# EAGLE design radiationsensor_r0 (EAGLE 6.5.0)
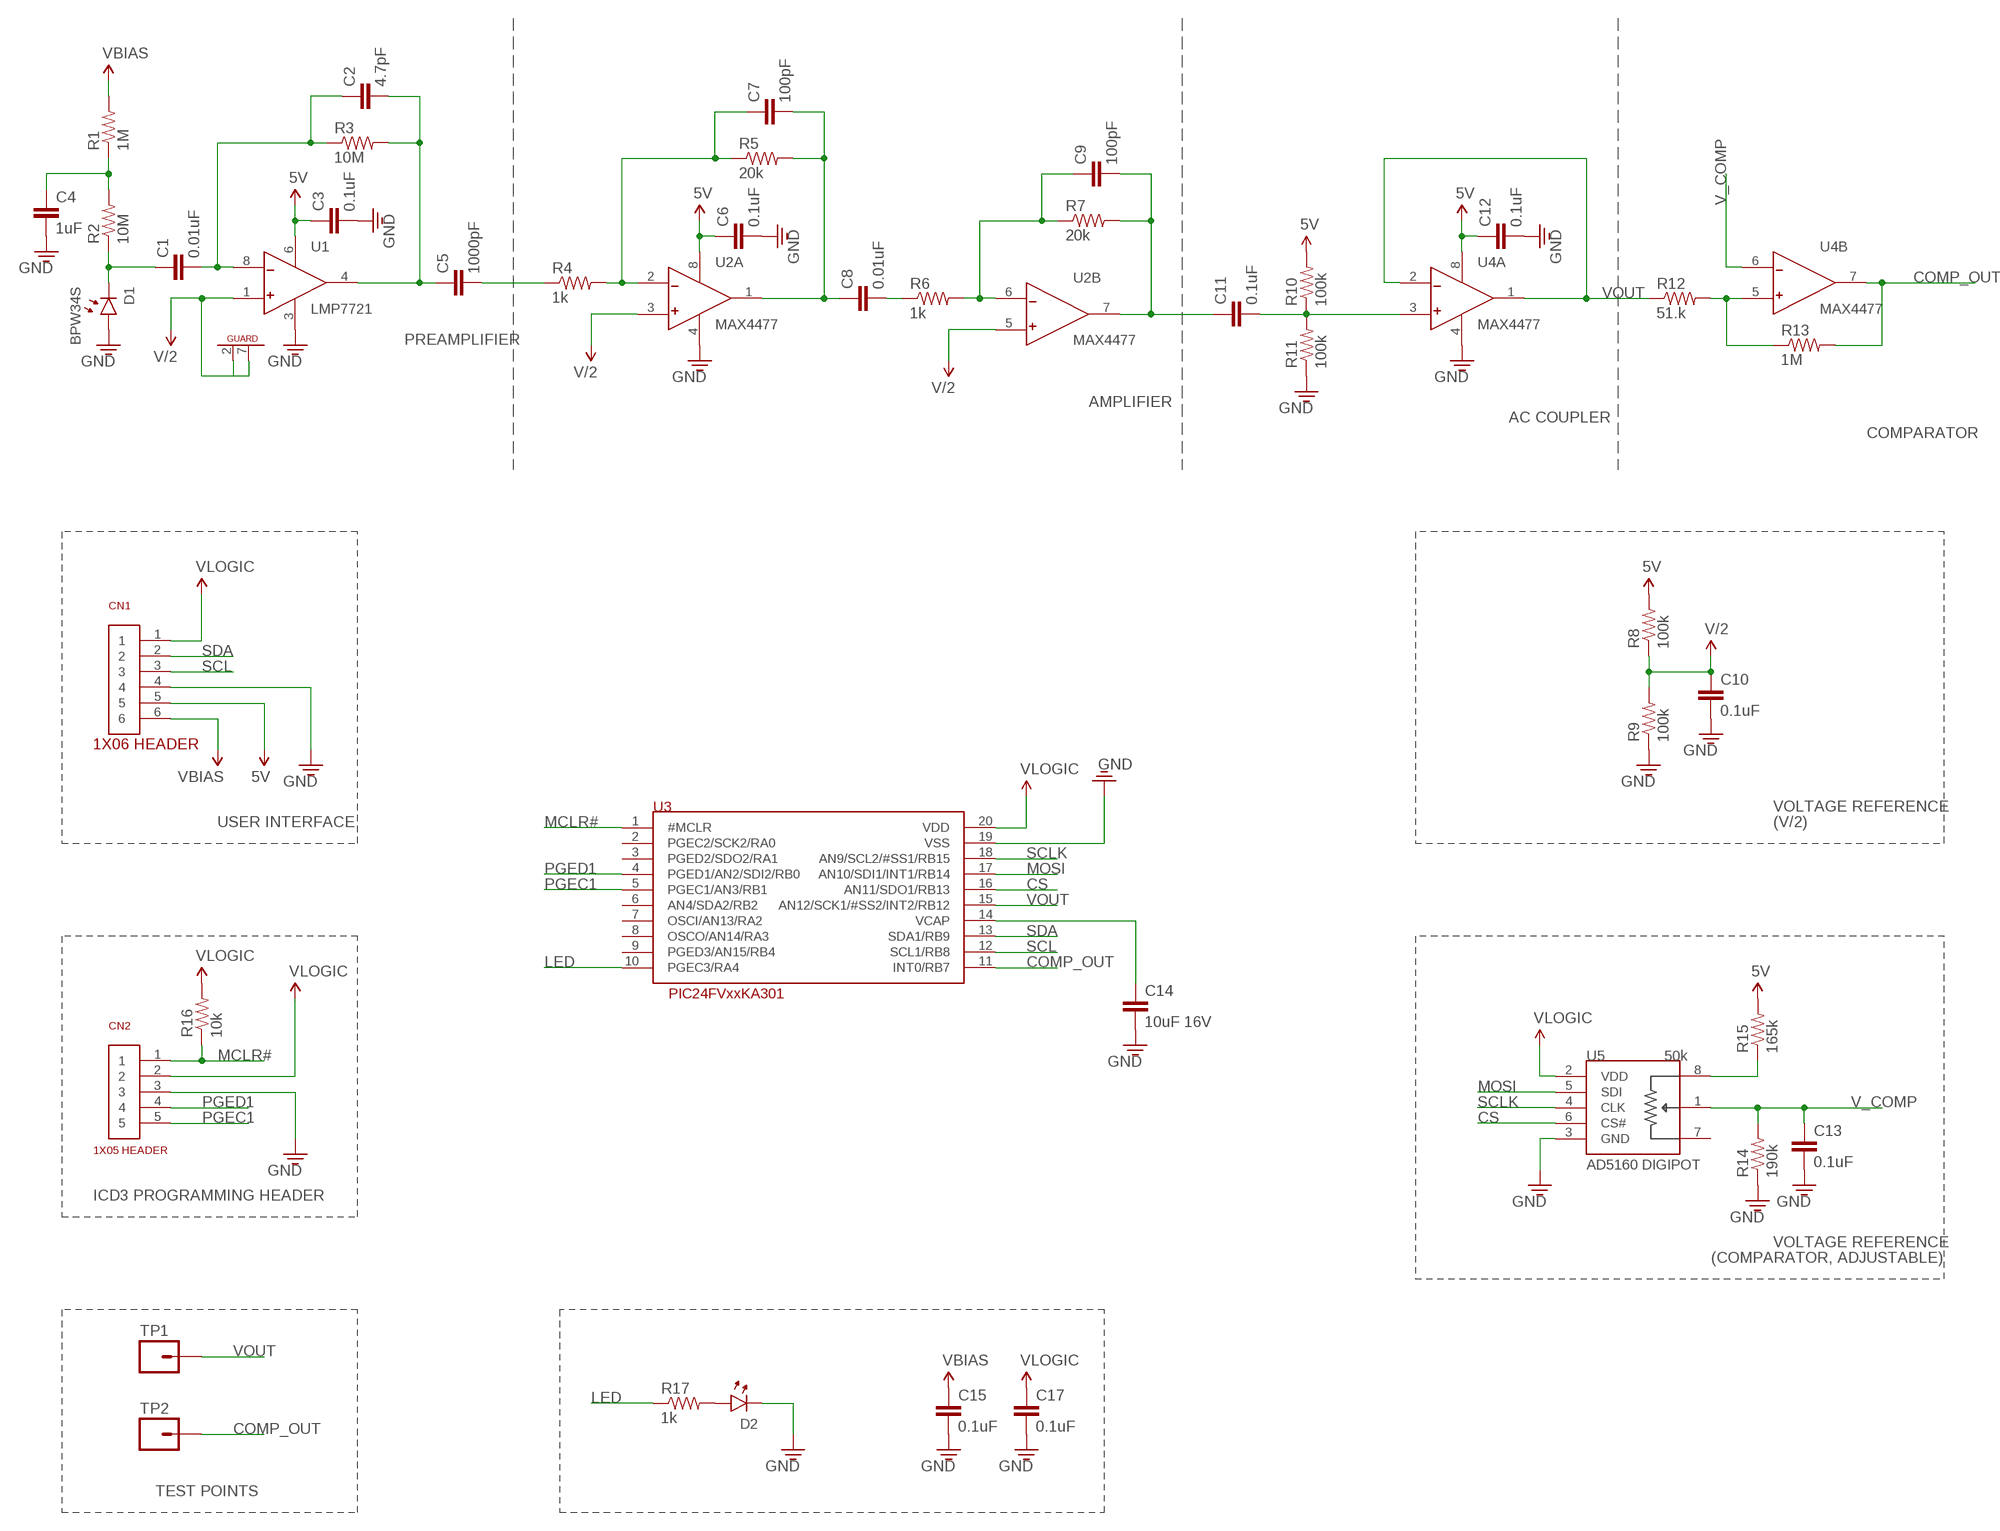
[diagram p0: schematic, sheet 1]

## Parts
C1  0.01uF  CAP0603  [0603]
C2  4.7pF  CAP0603  [0603]
C3  0.1uF  CAP0603  [0603]
C4  1uF  CAP0603  [0603]
C5  1000pF  CAP0603  [0603]
C6  0.1uF  CAP0603  [0603]
C7  100pF  CAP0603  [0603]
C8  0.01uF  CAP0603  [0603]
C9  100pF  CAP0603  [0603]
C10  0.1uF  CAP0603  [0603]
C11  0.1uF  CAP0603  [0603]
C12  0.1uF  CAP0603  [0603]
C13  0.1uF  CAP0603  [0603]
C14  10uF 16V  CAP0805  [0805]
C15  0.1uF  CAP0603  [0603]
C17  0.1uF  CAP0603  [0603]
CN1  1X06  [1X06]
CN2  1X05  [1X05]
D1  BPW34S  PHOTODIODE  [BPW34S-SIDEMOUNT]
D2  0605-LED  [0603-LED]
R1  1M  RESISTOR0603  [0603]
R2  10M  RESISTOR0603  [0603]
R3  10M  RESISTOR0603  [0603]
R4  1k  RESISTOR0603  [0603]
R5  20k  RESISTOR0603  [0603]
R6  1k  RESISTOR0603  [0603]
R7  20k  RESISTOR0603  [0603]
R8  100k  RESISTOR0603  [0603]
R9  100k  RESISTOR0603  [0603]
R10  100k  RESISTOR0603  [0603]
R11  100k  RESISTOR0603  [0603]
R12  51.k  RESISTOR0603  [0603]
R13  1M  RESISTOR0603  [0603]
R14  190k  RESISTOR0603  [0603]
R15  165k  RESISTOR0603  [0603]
R16  10k  RESISTOR0603  [0603]
R17  1k  RESISTOR0603  [0603]
TP1  M01PTH  [1X01]
TP2  M01PTH  [1X01]
U1  LMP7721  OPAMP-LMP7721  [SOIC-8]
U2  MAX4477  OPAMP-MAX4477  [SOIC-8]
U3  PIC24FVXXKA301  [SOIC-20]
U4  MAX4477  OPAMP-MAX4477  [SOIC-8]
U5  50k  AD5160  [SOT-23-8]

## Nets
5V: C3.1 C6.1 C12.1 CN1.5 R8.2 R10.2 R15.2 U1.6(VCC) U2.8(A:V+) U4.8(A:V+)
COMP_OUT: R13.2 TP2.1 U3.11(INT0/RB7) U4.7(B:OUT)
CS: U3.16(AN11/SDO1/RB13) U5.6(CS#)
GND: C3.2 C4.2 C6.2 C10.2 C12.2 C13.2 C14.2 C15.2 C17.2 CN1.4 CN2.3 D1.A(ANODE) D2.CATHODE R9.1 R11.1 R14.1 U1.3(GND) U2.4(A:V-) U3.19(VSS) U4.4(A:V-) U5.3(GND)
LED: R17.1 U3.10(PGEC3/RA4)
MCLR#: CN2.1 R16.1 U3.1(#MCLR)
MOSI: U3.17(AN10/SDI1/INT1/RB14) U5.5(SDI)
N$1: C1.2 C2.1 R3.1 U1.8(-)
N$2: C1.1 D1.C(CATHODE) R2.1
N$3: C7.2 C8.1 R5.2 U2.1(A:OUT)
N$4: C4.1 R1.1 R2.2
N$5: C7.1 R4.2 R5.1 U2.2(A:-)
N$6: C5.2 R4.1
N$7: C2.2 C5.1 R3.2 U1.4(OUT)
N$8: C9.1 R6.2 R7.1 U2.6(B:-)
N$9: C8.2 R6.1
N$10: C11.2 R10.1 R11.2 U4.3(A:+)
N$11: C9.2 C11.1 R7.2 U2.7(B:OUT)
N$12: D2.ANODE R17.2
N$14: R12.2 R13.1 U4.5(B:+)
N$15: C14.1 U3.14(VCAP)
N$17: R15.1 U5.8(A)
PGEC1: CN2.5 U3.5(PGEC1/AN3/RB1)
PGED1: CN2.4 U3.4(PGED1/AN2/SDI2/RB0)
SCL: CN1.3 U3.12(SCL1/RB8)
SCLK: U3.18(AN9/SCL2/#SS1/RB15) U5.4(CLK)
SDA: CN1.2 U3.13(SDA1/RB9)
V/2: C10.1 R8.1 R9.2 U1.1(+) U1.2(G1) U1.7(G2) U2.3(A:+) U2.5(B:+)
V_COMP: C13.1 R14.2 U4.6(B:-) U5.1(W)
VBIAS: C15.1 CN1.6 R1.2
VLOGIC: C17.1 CN1.1 CN2.2 R16.2 U3.20(VDD) U5.2(VDD)
VOUT: R12.1 TP1.1 U3.15(AN12/SCK1/#SS2/INT2/RB12) U4.1(A:OUT) U4.2(A:-)
Unconnected: U3.2(PGEC2/SCK2/RA0) U3.3(PGED2/SDO2/RA1) U3.6(AN4/SDA2/RB2) U3.7(OSCI/AN13/RA2) U3.8(OSCO/AN14/RA3) U3.9(PGED3/AN15/RB4) U5.7(B)

## Notes on the sheet
- PREAMPLIFIER
- AMPLIFIER
- AC COUPLER
- COMPARATOR
- VOLTAGE REFERENCE
- USER INTERFACE | (V/2)
- ICD3 PROGRAMMING HEADER
- VOLTAGE REFERENCE
- (COMPARATOR, ADJUSTABLE)
- TEST POINTS

## Library data of the parts
C1-C15 C17 = openct:CAP: Capacitor Standard 0603 ceramic capacitor, and 0.1" leaded capacitor.
CN1 = openct:1X06
CN2 = openct:1X05
D1 = openct:PHOTODIODE: Photodiodes sensitive to high-energy particles
D2 = openct:0605-LED
R1-R17 = openct:RESISTOR: Resistor Basic schematic elements and footprints for 0603, 1206, and PTH 1/10th watt (small) resistors.
TP1 TP2 = SparkFun-Connectors:M01: Header 1 Standard 1-pin 0.1" header. Use with straight break away headers (SKU : PRT-00116), right angle break away headers (PRT-00553), swiss pins (PRT-00743), machine pins (PRT-00117), and female headers (PRT-00115).
U1 = openct:OPAMP-LMP7721: TI LMP7721 Precision Amplifier (3-Femtoamp Input Bias)
U2 U4 = openct:OPAMP-MAX4477: Maxim MAX4477 Low-noise, low-distortion dual op amp
U3 = openct:PIC24FVXXKA301: Microchip PIC24FVxxKA301 microcontroller (2k ram, 12-bit adc, 2-5.5V operating voltage)
U5 = openct:AD5160: AD5160 Digipot (256-Position, SPI-Compatible)

## Board
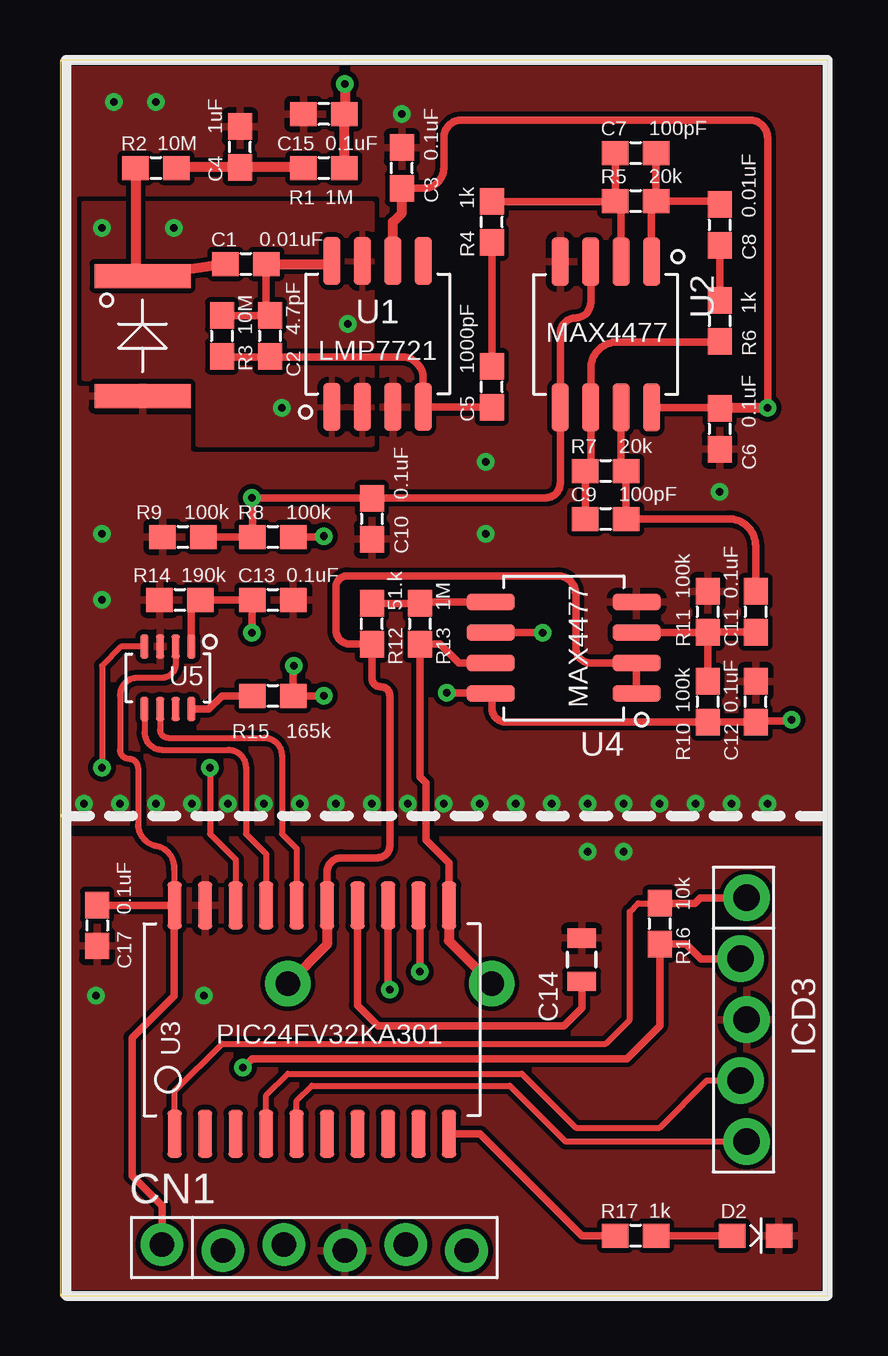
[diagram p1: board, top side]
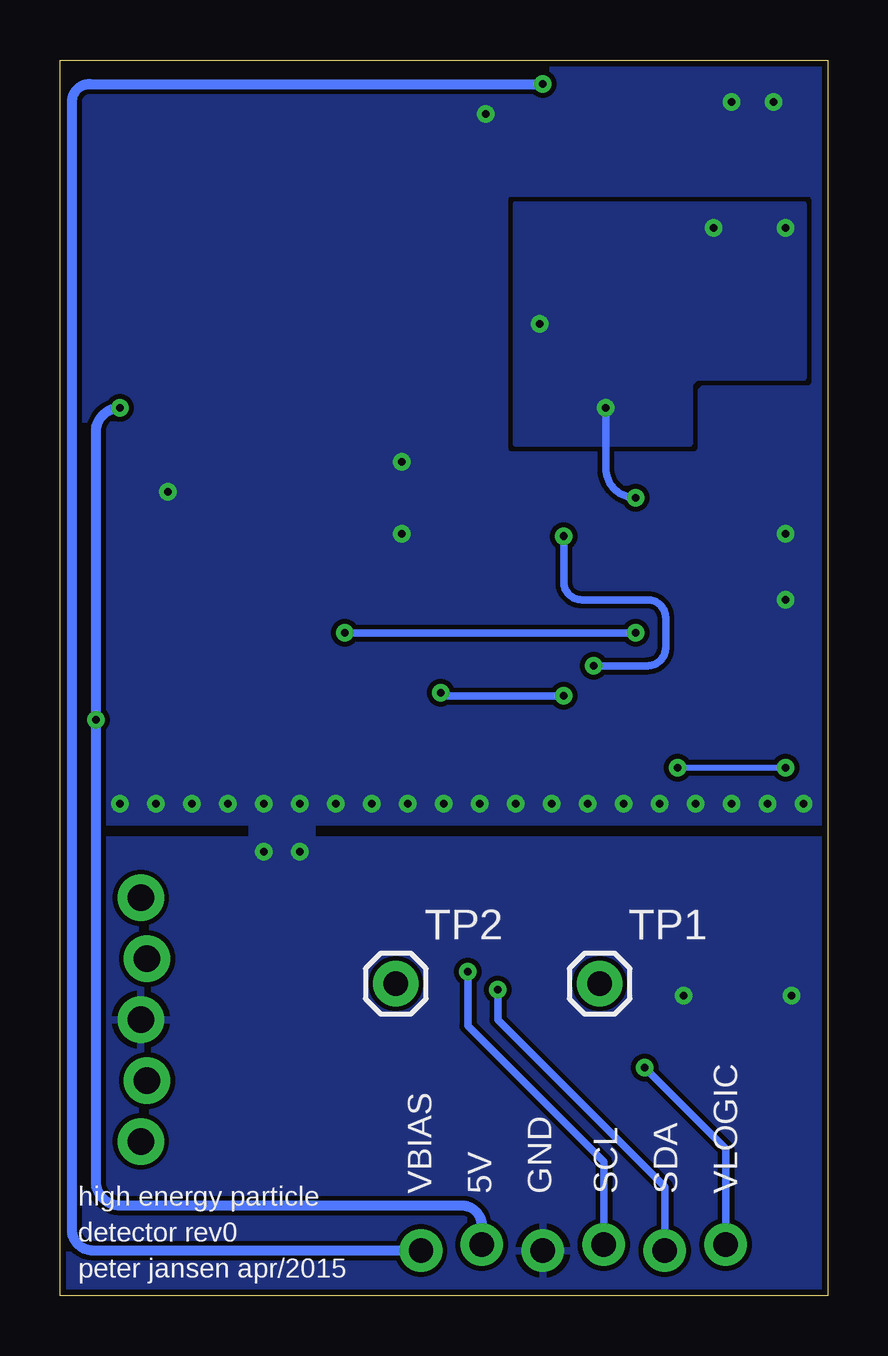
[diagram p2: board, bottom side, seen from below]

Size 32 x 51.5 mm. Coordinates in mm from the lower left corner, seen from the top.
Outline: 0,0 32,0 32,51.5 0,51.5 0,0
Copper layers (1*16): Top 0.035mm / dielectric 1.5mm / Bottom 0.035mm
Design rules "default *": minimum track width 10mil, minimum drill 13mil, track to track 8mil, track to pad 8mil, pad to pad 8mil, via to via 8mil, smd to smd 8mil, copper to edge 10mil, drill to drill 8mil, minimum pad ring 10mil, minimum via ring 8mil, stop-mask expansion 4mil, vias tented up to drill 0mil, thermal gap 10mil

### Footprints (pad centres in the part's own frame; a part is rotated, then mirrored left to right if it is on the bottom)
0603 = smd 1.1 x 1: 1 -0.85,0; 2 0.85,0
0805 = smd 0.8 x 1.2: 1 -0.9,0; 2 0.9,0
1X06 = drill 1.016 pad 1.778: 1 0,0.127; 2 2.54,-0.127; 3 5.08,0.127; 4 7.62,-0.127; 5 10.16,0.127; 6 12.7,-0.127
1X05 = drill 1.1 pad 1.93: 1 -5.08,0.127; 2 -2.54,-0.127; 3 0,0.127; 4 2.54,-0.127; 5 5.08,0.127
BPW34S-SIDEMOUNT = smd 1 x 4: A -2.5,-0.5; C 2.5,-0.5
0603-LED = smd 1.1 x 1: ANODE -0.975,0; CATHODE 0.975,0
1X01 = drill 1.016 pad 1.88: 1 0,0
SOIC-8 = smd 0.7 x 2: 1 -1.905,-3.04; 2 -0.635,-3.04; 3 0.635,-3.04; 4 1.905,-3.04; 5 1.905,3.04; 6 0.635,3.04; 7 -0.635,3.04; 8 -1.905,3.04
SOIC-20 = smd 0.6 x 2: 1 -5.715,-4.762; 2 -4.445,-4.762; 3 -3.175,-4.762; 4 -1.905,-4.762; 5 -0.635,-4.762; 6 0.635,-4.762; 7 1.905,-4.762; 8 3.175,-4.762; 9 4.445,-4.762; 10 5.715,-4.762; 11 5.715,4.763; 12 4.445,4.763; 13 3.175,4.763; 14 1.905,4.763; 15 0.635,4.763; 16 -0.635,4.763; 17 -1.905,4.763; 18 -3.175,4.763; 19 -4.445,4.763; 20 -5.715,4.763
SOT-23-8 = smd 0.35 x 1: 1 -0.975,-1.3; 2 -0.325,-1.3; 3 0.325,-1.3; 4 0.975,-1.3; 5 0.975,1.3; 6 0.325,1.3; 7 -0.325,1.3; 8 -0.975,1.3

### Placement (x,y rotation side)
C1  7.75,43 0 top
C2  8.75,40 270 top
C3  14.25,47 90 top
C4  7.5,47.88 90 top
C5  18,37.88 90 top
C6  27.5,36.12 270 top
C7  24,47.62 0 top
C8  27.5,44.62 270 top
C9  22.75,32.38 0 top
C10  13,32.38 270 top
C11  29,28.5 270 top
C12  29,24.75 90 top
C13  8.88,29 0 top
C14  21.75,14 90 top
C15  11,49.25 180 top
C17  1.55,15.42 270 top
CN1  4.25,2 0 top
CN2  28.5,11.5 270 top
D1  2.94,39.99 90 top
D2  29,2.5 0 top
R1  11,47 0 top
R2  4,47 0 top
R3  6.75,40 270 top
R4  18,44.75 90 top
R5  24,45.62 0 top
R6  27.5,40.62 270 top
R7  22.75,34.38 0 top
R8  8.88,31.62 0 top
R9  5.12,31.62 0 top
R10  27,24.75 270 top
R11  27,28.5 270 top
R12  13,28 90 top
R13  15,28 270 top
R14  5,29 0 top
R15  8.88,25 0 top
R16  25,15.5 270 top
R17  24,2.5 0 top
TP1  9.5,13 0 bottom
TP2  18,13 0 bottom
U1  13.24,40.08 0 top
U2  22.76,40.05 180 top
U3  10.5,11.5 0 top
U4  21,27 90 top
U5  4.5,25.75 180 top

### Tracks (layer width: path | path; a pad name or v marks a point on that pad's centre or on a via)
5V  (via drill 0.33)
  Top 0.305: U2.8 27.46,37.02 arc90 C6.1 | v29.5,37 29.5,48.25 arc90 28.75,49 16.75,49 arc90 16,48.25 16,47 arc-90 15.15,46.15 C3.1 | R10.2 18.6,23.9 arc-90 18,24.5 18,25.05 U4.8 17.91,25.05 arc-90 17.86,25.12 v16.12,25.12 | v9.75,26.25 9.73,26.23 R15.2 v11,25 | R8.2 10.98,31.62 v11,31.65 | v30.5,24 30.45,23.95 29.12,23.95 C12.1 R10.2 | R10.2 27.08,23.83
  Top 0.406: U1.6 13.88,44.75 14.25,45.12 C3.1 | v29.5,37 27.52,37 arc90 C6.1
  Bottom 0.305: v9.75,26.25 7.5,26.25 arc-90 6.75,27 6.75,28.25 arc-90 7.5,29 10.25,29 arc90 11,29.75 v11,31.65 | v16.12,25.12 16,25 v11,25
  Bottom 0.406: CN1.5 14.41,2.91 arc-90 15.25,3.75 29.5,3.75 arc90 30.5,4.75 v30.5,24 30.5,36 arc90 v29.5,37
COMP_OUT
  Top 0.305: U4.7 16.64,26.37 15.85,27.15 R13.2 15,21.62 15.25,21.38 15.25,19 16.21,18.04 U3.11
  Top 0.406: U3.11 16.21,14.79 TP2.1
CS
  Top 0.254: U5.6 4.18,23.58 arc90 4.5,23.25 8.5,23.25 arc-90 9.25,22.5 9.25,19.25 9.86,18.64 U3.16
GND  (via drill 0.33)
  other vias: 1,20.5 2.5,20.5 4,20.5 5.5,20.5 7,20.5 8.5,20.5 10,20.5 11.5,20.5 13,20.5 14.5,20.5 16,20.5 17.5,20.5 19,20.5 20.5,20.5 22,20.5 23.5,20.5 25,20.5 26.5,20.5 28,20.5 29.5,20.5 22,18.5 23.5,18.5 6,12.5 1.5,12.5 17.75,31.75 1.75,31.75 1.75,29 17.75,34.75 2.25,49.75 4,49.75 14.25,49.25 27.5,33.5
  pour Top (rank 3): 0.25,19.75 0.25,51.5 32,51.5 32,19.75
  pour Bottom (rank 3): 0.25,19.75 0.25,51.5 32,51.5 32,19.75
  pour Bottom (rank 3): 0.25,0 0.25,19 32,19 32,0
  pour Top (rank 3): 0.25,19 32,19 32,0 0.25,0
  pour Bottom (rank 3): 21.5,21 21.5,18 24,18 24,21
LED
  Top 0.305: U3.10 17.51,6.74 21.75,2.5 R17.1
MCLR#
  Top 0.254: U3.1 4.79,8.54 6.75,10.5 22.75,10.5 23.75,11.5 23.75,16 24.1,16.35 R16.1
  Top 0.305: CN2.1 26.7,16.58 26.48,16.35 R16.1
MOSI
  Top 0.254: U5.5 3.53,23.48 arc90 4.25,22.75 7,22.75 arc-90 7.75,22 7.75,19.25 8.59,18.41 U3.17
N$1
  Top 0.305: R3.1 C2.1 arc-90 8.6,41 C1.2
  Top 0.406: C1.2 11.21,43 arc90 U1.8
N$2
  Top 0.406: C1.1 D1.C 3.15,42.49 R2.1
N$3
  Top 0.305: C7.2 R5.2 | U2.1 24.66,45.44 R5.2 | R5.2 27.35,45.62 C8.1
N$4
  Top 0.406: R1.1 10.15,47.02 C4.1 4.88,47.02 arc90 R2.2
N$5
  Top 0.305: C7.1 R5.1 | U2.2 23.4,45.38 R5.1 | R4.2 23.12,45.6 R5.1
N$6
  Top 0.305: C5.2 R4.1
N$7
  Top 0.305: 8.75,39.12 14.25,39.12 arc-90 15.14,38.23 U1.4 17.98,37.04 C5.1 | 8.75,39.12 6.78,39.12 arc-90 R3.2 | C2.2 8.75,39.12
N$8
  Top 0.305: C9.1 R7.1 22.12,34.6 U2.6 22.12,38.62 arc-90 23.25,39.75 27.48,39.75 arc90 R6.2
N$9
  Top 0.305: C8.2 R6.1
N$10
  Top 0.305: R10.1 R11.2 | U4.3 26.98,27.63 R11.2 | R11.2 C11.2
N$11
  Top 0.305: C11.1 29,31.25 arc90 27.88,32.38 C9.2 R7.2 23.4,34.58 U2.7
N$12
  Top 0.305: R17.2 D2.ANODE
N$14
  Top 0.305: U4.5 15.05,28.91 R13.1 R12.2
N$15
  Top 0.305: U3.14 12.41,12.09 13.25,11.25 21,11.25 21.75,12 C14.1
N$17
  Top 0.305: U5.8 6.2,24.45 6.75,25 R15.1
PGEC1
  Top 0.254: U3.5 9.86,8.11 10.5,8.75 18.75,8.75 21.08,6.42 CN2.5
PGED1
  Top 0.254: U3.4 8.59,8.34 9.5,9.25 19.25,9.25 21.5,7 25,7 26.96,8.96 CN2.4
SCL  (via drill 0.33)
  Top 0.305: U3.12 15,16.21 v15,13.5
  Bottom 0.305: v15,13.5 15,11.25 9.33,5.58 CN1.3
SCLK  (via drill 0.33)
  Top 0.254: U5.4 2.55,27.05 1.75,26.25 v1.75,22 | v6.25,22 6.25,19.25 7.32,18.18 U3.18
  Bottom 0.254: v1.75,22 v6.25,22
SDA  (via drill 0.33)
  Top 0.305: U3.13 13.68,12.82 v13.75,12.75
  Bottom 0.305: v13.75,12.75 13.75,11.5 6.79,4.54 CN1.2
V/2  (via drill 0.33)
  Top 0.305: U2.3 22.12,41.38 arc-90 21.5,40.75 arc90 20.86,40.1 U2.5 20.86,33.85 arc-90 20.25,33.25 13.02,33.25 C10.1 12.98,33.25 v8,33.25 8.02,33.23 R8.1 R9.2
  Bottom 0.305: v8,33.25 arc90 9.25,34.5 v9.25,37
  other vias: 12,40.5 4.75,44.5 1.75,44.5
  pour Top: 13,35.5 13,45.5 1,45.5 1,38.25 5.25,38.25 5.75,37.75 5.75,35.5
  pour Bottom: 13,35.5 13,45.5 1,45.5 1,38.25 5.5,38.25 5.75,38 5.75,35.5
V_COMP  (via drill 0.33)
  Top 0.305: U5.1 5.47,28.62 R14.2 C13.1 | 8,29.02 arc90 C13.1 | U4.6 20.11,27.63 arc-90 v20.12,27.62 | v8,27.62 8,28.98 arc-90 C13.1
  Bottom 0.305: v20.12,27.62 v8,27.62
VBIAS  (via drill 0.33)
  Top 0.406: v11.88,50.5 11.88,49.27 arc-90 C15.1 R1.2
  Bottom 0.406: CN1.6 30.62,1.87 arc90 31.5,2.75 31.5,49.75 arc90 30.75,50.5 v11.88,50.5
VLOGIC  (via drill 0.33)
  Top 0.254: U5.2 4.82,26.33 arc-90 4.25,25.75 3.25,25.75 arc90 2.5,25 2.5,22.75 arc90 2.88,22.38 arc-90 3.25,22 3.25,19.62 arc77 4,18.75 arc-85 4.75,17.75 4.75,16.3 U3.20
  Top 0.305: C17.1 1.56,16.26 U3.20 4.75,16.23 4.75,12.5 3,10.75 3,5 4.25,3.75 CN1.1 | CN2.2 26.71,14.04 26.1,14.65 R16.2 25,11.25 23.62,9.88 8,9.88 v7.62,9.5
  Bottom 0.305: v7.62,9.5 4.25,6.12 CN1.1
VOUT
  Top 0.305: U4.1 U4.2 22.14,26.37 arc-90 21.5,27 21.5,29.25 arc90 20.75,30 12,30 arc90 11.5,29.5 11.5,27.75 arc90 12.1,27.15 R12.1 13,25.75 arc90 13.38,25.38 arc-90 13.75,25 13.75,18.75 arc-90 13.25,18.25 11.75,18.25 arc90 11.14,17.64 U3.15
  Top 0.406: U3.15 11.14,14.64 TP1.1

### Text on the board
tPlace: MAX4477 | LMP7721 | MAX4477 | PIC24FV32KA301 | ICD3
bPlace: VLOGIC | SDA | SCL | GND | 5V | VBIAS | high energy particle | detector rev0 | peter jansen apr/2015